# EAGLE design LED_IF_circuit2 (EAGLE 8.2.1)
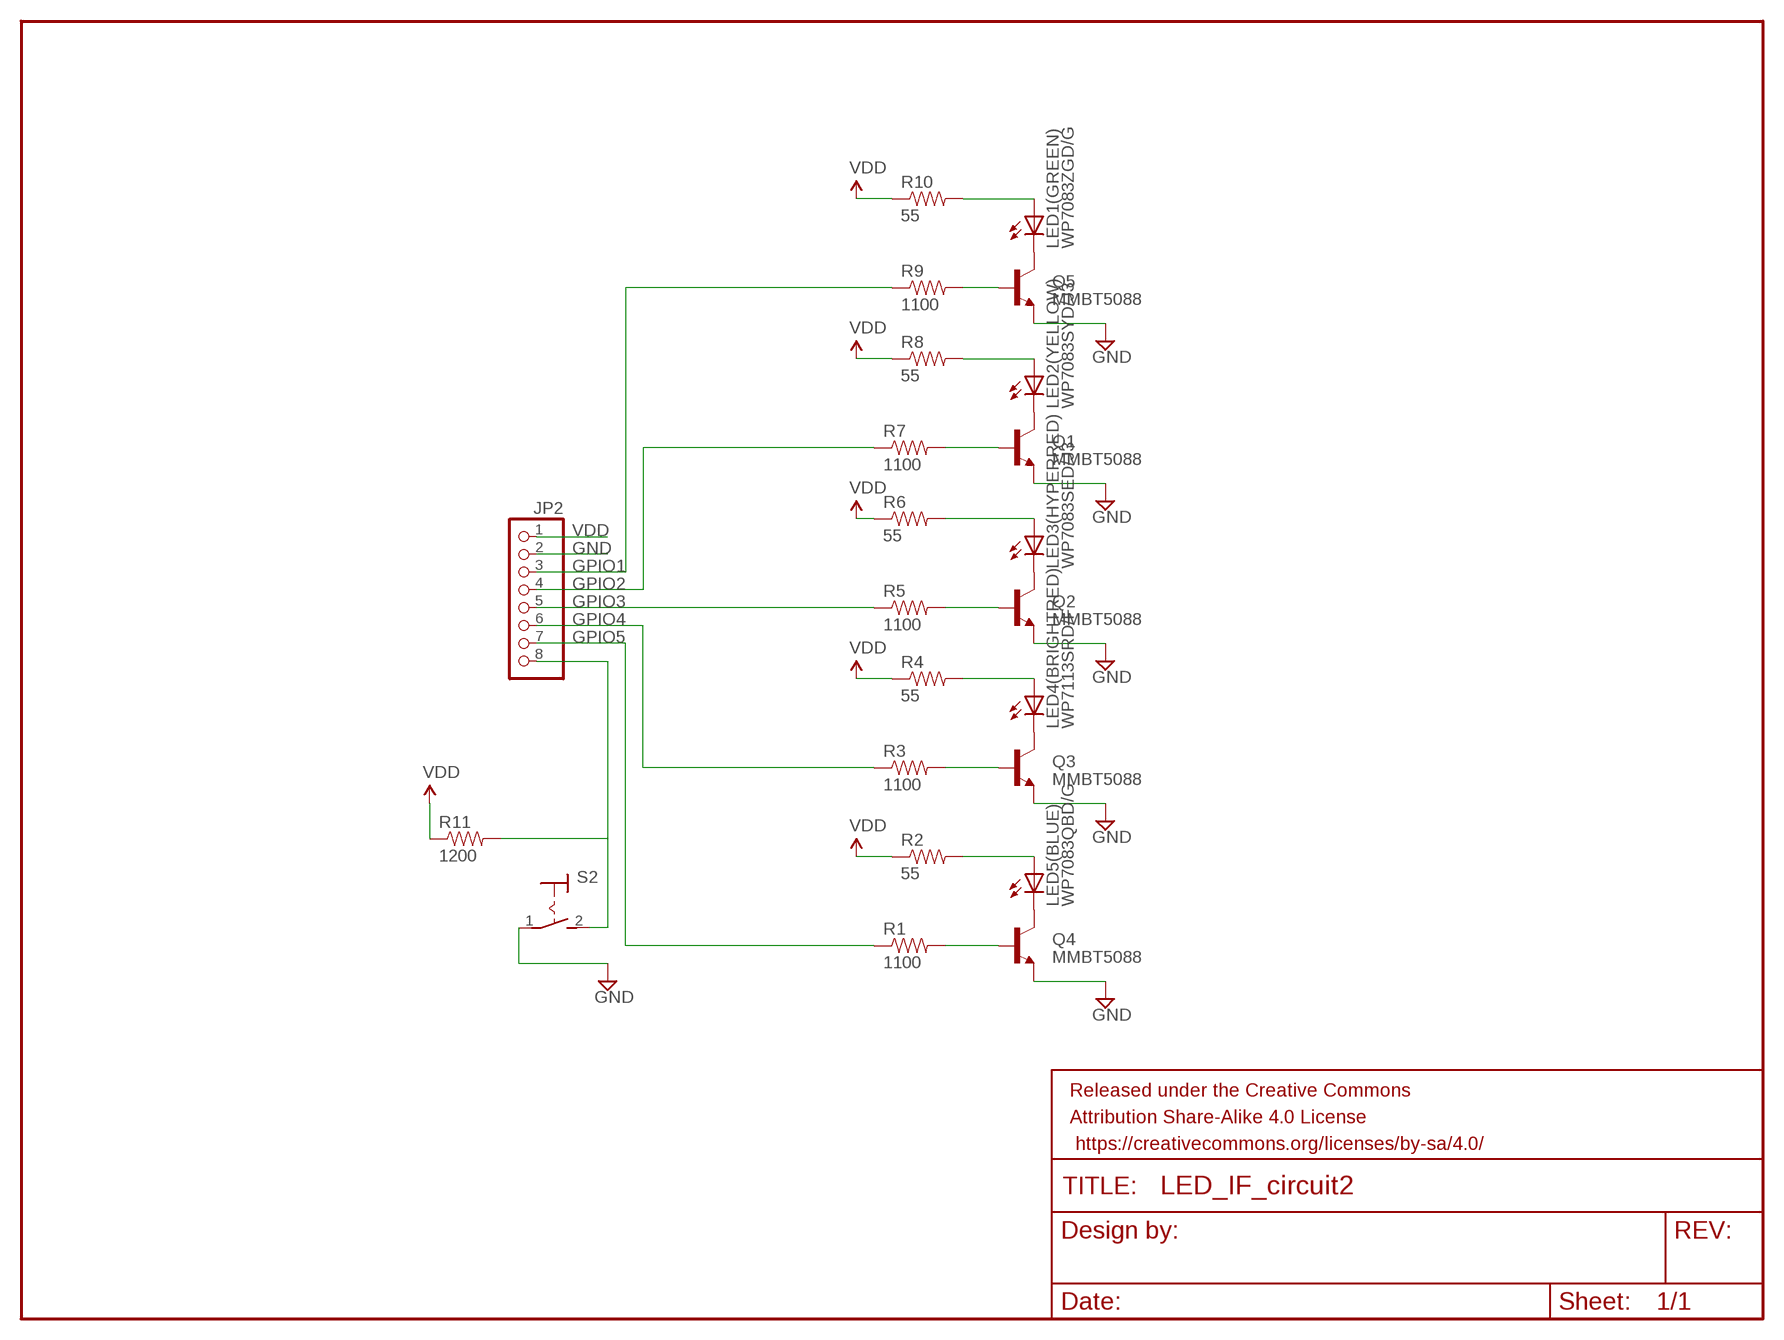
[diagram p0: schematic, sheet 1]

## Parts
FRAME1  FRAME-LETTERNO_PACKAGE  [DUMMY]
JP2  PINHD-1X8  [1X08]
LED1(GREEN)  WP7083ZGD/G  LED5MM  [LED5MM]
LED2(YELLOW)  WP7083SYD/J3  LED5MM  [LED5MM]
LED3(HYPERRED)  WP7083SED/J3  LED5MM  [LED5MM]
LED4(BRIGHTRED)  WP7113SRD/F  LED5MM  [LED5MM]
LED5(BLUE)  WP7083QBD/G  LED5MM  [LED5MM]
Q1  MMBT5088  TRANSISTOR_NPNMMBT5088  [SOT23-3]
Q2  MMBT5088  TRANSISTOR_NPNMMBT5088  [SOT23-3]
Q3  MMBT5088  TRANSISTOR_NPNMMBT5088  [SOT23-3]
Q4  MMBT5088  TRANSISTOR_NPNMMBT5088  [SOT23-3]
Q5  MMBT5088  TRANSISTOR_NPNMMBT5088  [SOT23-3]
R1  1100  RESISTOR0603-RES  [0603-RES]
R2  55  RESISTOR0603-RES  [0603-RES]
R3  1100  RESISTOR0603-RES  [0603-RES]
R4  55  RESISTOR0603-RES  [0603-RES]
R5  1100  RESISTOR0603-RES  [0603-RES]
R6  55  RESISTOR0603-RES  [0603-RES]
R7  1100  RESISTOR0603-RES  [0603-RES]
R8  55  RESISTOR0603-RES  [0603-RES]
R9  1100  RESISTOR0603-RES  [0603-RES]
R10  55  RESISTOR0603-RES  [0603-RES]
R11  1200  RESISTOR0603-RES  [0603-RES]
S2  MS243TMS6T5B2M2RETMS6T5B2M2RE  [MS243]

## Nets
GND: JP2.2 Q1.2(E) Q2.2(E) Q3.2(E) Q4.2(E) Q5.2(E) S2.1(P)
GPIO1: JP2.3 R9.1
GPIO2: JP2.4 R7.1
GPIO3: JP2.5 R5.1
GPIO4: JP2.6 R3.1
GPIO5: JP2.7 R1.1
N$1: LED1(GREEN).K(C) Q5.3(C)
N$2: LED2(YELLOW).K(C) Q1.3(C)
N$3: LED3(HYPERRED).K(C) Q2.3(C)
N$4: LED4(BRIGHTRED).K(C) Q3.3(C)
N$5: LED5(BLUE).K(C) Q4.3(C)
N$6: LED1(GREEN).A R10.2
N$8: Q5.1(B) R9.2
N$9: LED2(YELLOW).A R8.2
N$10: Q1.1(B) R7.2
N$11: LED5(BLUE).A R2.2
N$12: Q3.1(B) R3.2
N$13: LED4(BRIGHTRED).A R4.2
N$14: Q2.1(B) R5.2
N$15: LED3(HYPERRED).A R6.2
N$16: Q4.1(B) R1.2
N$17: JP2.8 R11.2 S2.2(S)
VDD: JP2.1 R2.1 R4.1 R6.1 R8.1 R10.1 R11.1

## Library data of the parts
FRAME1 = SparkFun-Aesthetics:FRAME-LETTER: Schematic Frame Standard 8.5x11 US Letter frame; DESIGNER: Nobody; VERSION: v01
JP2 = pinhead:PINHD-1X8: PIN HEADER
LED1(GREEN) LED2(YELLOW) LED3(HYPERRED) LED4(BRIGHTRED) LED5(BLUE) = adafruit:LED: LED OSRAM: - CHIPLED LG R971, LG N971, LY N971, LG Q971, LY Q971, LO R971, LY R971 LH N974, LH R974 LS Q976, LO Q976, LY Q976 LO Q996 - Hyper CHIPLED LW Q18S LB Q993, LB Q99A, LB R99A - SideLED LS A670, LO A670, LY A670, LG A670, LP A670 LB A673, LV A673, LT A673, LW A673 LH A674 LY A675 LS A676, LA A676, LO A676, LY A676, LW A676 LS A679, LY A679, LG A679 - Hyper Micro SIDELED® LS Y876, LA Y876, LO Y876, LY Y876 LT Y87S - SmartLED LW L88C, LW L88S LB L89C, LB L89S, LG L890 LS L89K, LO L89K, LY L89K LS L896, LA L896, LO L896, LY L896 - TOPLED LS T670, LO T670, LY T670, LG T670, LP T670 LSG T670, LSP T670, LSY T670, LOP T670, LYG T670 LG T671, LOG T671, LSG T671 LB T673, LV T673, LT T673, LW T673 LH T674 LS T676, LA T676, LO T676, LY T676, LB T676, LH T676, LSB T676, LW T676 LB T67C, LV T67C, LT T67C, LS T67K, LO T67K, LY T67K, LW E67C LS E67B, LA E67B, LO E67B, LY E67B, LB E67C, LV E67C, LT E67C LW T67C LS T679, LY T679, LG T679 LS T770, LO T770, LY T770, LG T770, LP T770 LB T773, LV T773, LT T773, LW T773 LH T774 LS E675, LA E675, LY E675, LS T675 LS T776, LA T776, LO T776, LY T776, LB T776 LHGB T686 LT T68C, LB T68C - Hyper Mini TOPLED® LB M676 - Mini TOPLED Santana® LG M470 LS M47K, LO M47K, LY M47K Source: http://www.osram.convergy.de/
Q1-Q5 = SparkFun-DiscreteSemi:TRANSISTOR_NPN: Generic NPN BJT MMBT2222A - TRANS-08049 (SOT-23, 1A 40V) MPSA42 - TRANS-09116 (SOT-23, 500mA 300V) MMBT5088LT1G - TRANS-11160 (SOT-23, 50 mA 30V) BC547 - COM-08928 <http://www.sparkfun.com/products/8928> (TO-92 45V 100mA) (1.Collector 2.Base 3.Emitter) 2N3904 - COM-00521 <http://www.sparkfun.com/products/521> (TO-92 40V 200mA) (1.Emitter 2.Base 3.Collector) P2N2222A - COM-12852 <http://www.sparkfun.com/products/12852> (TO-92 40V 600mA) (1.Collector 2.Base 3.Emitter); PROD_ID: TRANS-11160
R1-R11 = SparkFun-Passives:RESISTOR: Resistor Basic schematic elements and footprints for 0603, 1206, and PTH resistors.
S2 = switch:MS243: TOGGLE SWITCH

## Net classes
0 default: clearance 0.205 mm

## Board
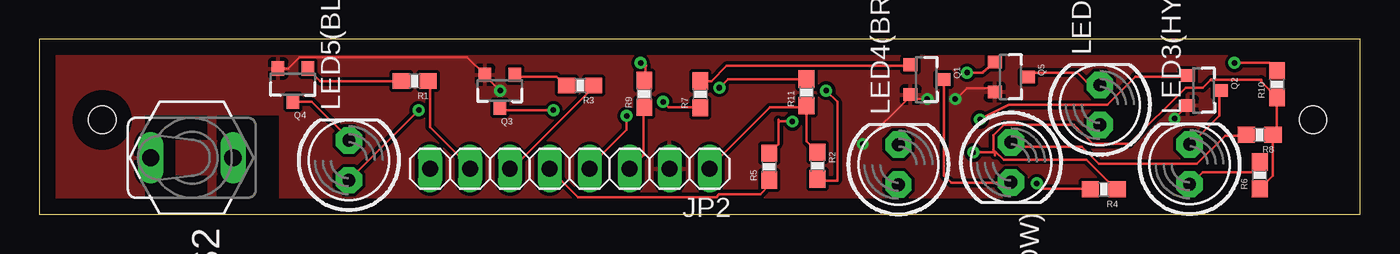
[diagram p1: board, top side]
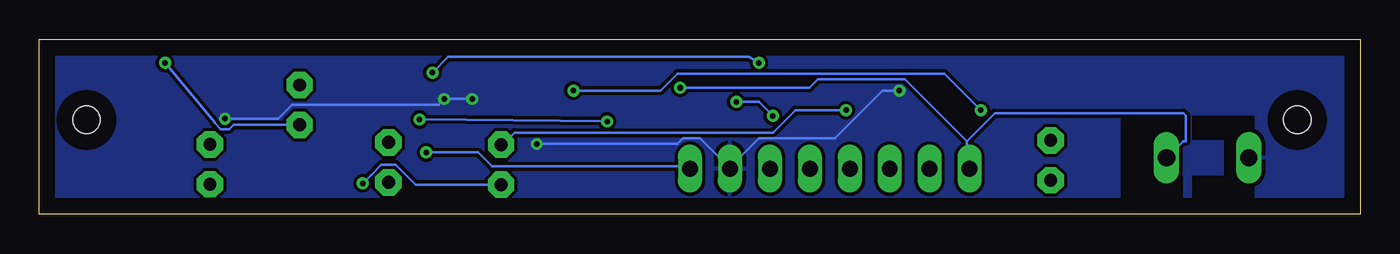
[diagram p2: board, bottom side, seen from below]

Size 84 x 11.12 mm. Coordinates in mm from the lower left corner, seen from the top.
Outline: 0,0 84,0 84,11.12 0,11.12 0,0
Copper layers (1*16): Top 0.035mm / dielectric 1.5mm / Bottom 0.035mm
Design rules "default": minimum track width 6mil, minimum drill 0.35mm, track to track 6mil, track to pad 6mil, pad to pad 6mil, via to via 6mil, smd to smd 6mil, copper to edge 40mil, drill to drill 6mil, minimum pad ring 10mil, minimum via ring 8mil, stop-mask expansion 4mil, vias tented up to drill 0mil, thermal gap 10mil
Holes 1.74 mm at 4,6 81,6

### Footprints (pad centres in the part's own frame; a part is rotated, then mirrored left to right if it is on the bottom)
1X08 = drill 1.016 long: 1 -8.89,0; 2 -6.35,0; 3 -3.81,0; 4 -1.27,0; 5 1.27,0; 6 3.81,0; 7 6.35,0; 8 8.89,0
LED5MM = drill 0.813 pad 1.676 octagon: A -1.27,0; K 1.27,0
SOT23-3 = smd 0.8 x 0.9: 1 -0.95,-1; 2 0.95,-1; 3 0,1.1
0603-RES = smd 1.1 x 1: 1 -0.85,0; 2 0.85,0
MS243 = drill 1.09 pad 1.27 long: 1 0,-3.886; 2 0,1.346

### Placement (x,y rotation side)
FRAME1  -29.21,54.61 0 top  (outside the outline)
JP2  33.73,2.9 180 top
LED1(GREEN)  67.44,6.95 90 top
LED2(YELLOW)  61.79,3.3 270 top
LED3(HYPERRED)  73.15,3.17 90 top
LED4(BRIGHTRED)  54.63,3.15 90 top
LED5(BLUE)  19.68,3.43 90 top
Q1  56.4,8.56 270 top
Q2  74.04,7.87 270 top
Q3  29.29,7.87 180 top
Q4  16.13,8.26 180 top
Q5  61.76,8.73 270 top
R1  23.87,8.47 180 top
R2  49.48,3.08 270 top
R3  34.4,8.19 180 top
R4  67.69,1.59 180 top
R5  46.41,3.02 90 top
R6  77.61,2.47 90 top
R7  42.04,7.62 90 top
R8  77.61,5.06 180 top
R9  38.47,7.65 90 top
R10  78.71,8.27 90 top
R11  48.79,7.75 90 top
S2  10.97,3.59 270 top

### Tracks (layer width: path | path; a pad name or v marks a point on that pad's centre or on a via)
GND  (via drill 0.35)
  Top 0.152: v52.36,4.47 55.4,7.5 Q1.2 55.58,7.5 55.75,7.33 v56.47,7.33 | v29.31,7.86 28.41,8.76 Q3.2 27.21,9.99 16.56,9.99 15.83,9.26 Q4.2 | v72.19,6.08 72.91,6.79 Q2.2 | v58.26,7.33 58.33,7.33 59,8 60.67,8 Q5.2
  Bottom 0.152: v52.36,4.47 43.42,4.47 43.07,4.83 41.99,4.83 40.21,3.04 JP2.2 40.03,3.04 38.24,4.83 33.42,4.83 30.38,7.86 v29.31,7.86 | v56.47,7.33 v58.26,7.33 58.61,6.97 67.91,6.97 68.8,6.08 v72.19,6.08
  pour Bottom: 0,0 0,11 84,11 84,0
  pour Top: 0,0 0,11 84,11 84,0
GPIO1
  Top 0.152: R9.1 38.42,6.79 38.42,3.75 37.71,3.04 JP2.3
GPIO2  (via drill 0.35)
  Top 0.152: v39.67,7.15 40.03,6.79 41.99,6.79 R7.1 | v37.35,6.25 37.35,5.36 35.02,3.04 JP2.4
  Bottom 0.152: v39.67,7.15 38.24,7.15 v37.35,6.25
GPIO3
  Top 0.152: 46.51,2.08 R5.1 46.41,1.84 45.85,1.27 43.23,1.27 43.05,1.09 34.27,1.09 JP2.5
GPIO4
  Top 0.152: R3.1 35.2,8.04 30.02,2.86 JP2.6
GPIO5
  Top 0.152: R1.1 24.84,8.4 24.84,5.54 27.34,3.04 JP2.7
N$1
  Top 0.152: 67.37,8.22 LED1(GREEN).K 66.78,8.22 66,9 63.01,9 Q5.3
N$2
  Top 0.152: 61.47,1.79 61.83,1.79 LED2(YELLOW).K 61.76,2 58,2 57.54,2.46 57.54,8.4 Q1.3
N$3
  Top 0.152: Q2.3 75.05,7.86 75.05,6.25 73.27,4.47 LED3(HYPERRED).K
N$4  (via drill 0.35)
  Top 0.152: v32.7,6.61 29.31,6.61 Q3.3
  Bottom 0.152: v32.7,6.61 35.92,6.61 37.35,5.18 53.79,5.18 54.5,4.47 LED4(BRIGHTRED).K
N$5
  Top 0.152: Q4.3 16.26,7.15 17.33,7.15 19.66,4.83 LED5(BLUE).K
N$6  (via drill 0.35)
  Top 0.152: 79,9.28 R10.2 78.21,9.62 v76,9.62
  Bottom 0.152: v76,9.62 72.85,5.85 72.85,5.8 72.47,5.42 71.92,5.42 71.66,5.68 LED1(GREEN).A
N$8  (via drill 0.35)
  Top 0.152: v38.24,9.62 38.6,9.47 R9.2 | v59,9 60,9 60,9.04 Q5.1
  Bottom 0.152: v59,9 58,10 38.87,10 v38.24,9.62
N$9
  Top 0.152: R8.2 76.66,5 75.41,5 73.62,3.22 67.37,3.22 66.3,4.29 62.01,4.29 LED2(YELLOW).A
N$10
  Top 0.152: R7.2 42.74,8.47 43.7,9.43 55.32,9.43 Q1.1
N$11  (via drill 0.35)
  Top 0.152: v50.04,7.86 50.75,7.15 50.75,2.14 49.57,2.14 R2.2 | v24.12,6.61 19.84,2.32 LED5(BLUE).A
  Bottom 0.152: v50.04,7.86 44.5,7.86 43.42,8.94 26.45,8.94 v24.12,6.61
N$12
  Top 0.152: Q3.1 30.38,8.76 32.88,8.76 33.42,8.22 R3.2
N$13  (via drill 0.35)
  Top 0.152: v63.44,1.97 63.8,1.61 66.83,1.61 R4.2
  Bottom 0.152: 54.68,1.97 LED4(BRIGHTRED).A 60.06,1.88 61.33,3.15 62.26,3.15 62.91,2.49 v63.44,1.97
N$14  (via drill 0.35)
  Top 0.152: v59.82,6.02 61.65,6.97 67.91,6.97 69.69,8.76 72.91,8.76 Q2.1 | v47.89,5.9 47.1,5.9 47,6 47,4.46 R5.2
  Bottom 0.152: v47.89,5.9 v59.82,6.02
N$15
  Top 0.152: R6.2 77.2,2.68 73.98,2.68 73.27,1.97 LED3(HYPERRED).A
N$16
  Top 0.152: Q4.1 17.87,8.47 R1.2
N$17  (via drill 0.35)
  Top 0.152: v43.24,8.04 43.78,8.58 48.78,8.58 R11.2
  Bottom 0.152: v43.24,8.04 35.02,8.04 34.49,8.58 28.95,8.58 25.02,4.65 | 25.02,4.65 25.02,3.04 JP2.8 | 25.02,4.65 23.23,6.43 11.26,6.43 11.08,6.25 11.08,4.65 11.26,4.65 12.15,3.75 S2.2
VDD  (via drill 0.35)
  Top 0.152: JP2.1 42.71,3.04 46.46,6.79 48.78,6.79 R11.1 48.79,4.62 R2.1 | 77.38,1.25 R6.1 78.45,2.46 R8.1 | R8.1 78.45,5 78.84,5.39 | 60.76,3.75 60.76,3.93 | 74.52,8.58 74.47,8.53 | 74.47,8.53 73.98,8.04 72.91,8.04 69.34,4.47 67.01,4.47 65.79,5.69 61.33,5.69 60.67,5.03 60.67,4.11 60.85,3.93 | R4.1 68.44,1.61 66.6,3.45 61.33,3.45 60.85,3.93 | 78.63,5.18 R8.1 | 60.76,3.93 v59.4,3.93 | 60.76,3.93 60.85,3.93 | 74.47,8.53 74.55,8.53 74.58,8.55 77.7,8.55 77.7,8.43 R10.1 78.71,5.31 R8.1
  Bottom 0.152: v59.4,3.93 56.11,3.93 55.22,3.04 42.71,3.04 JP2.1